# EAGLE design PedoBreakOutv1 (EAGLE 9.5.2)
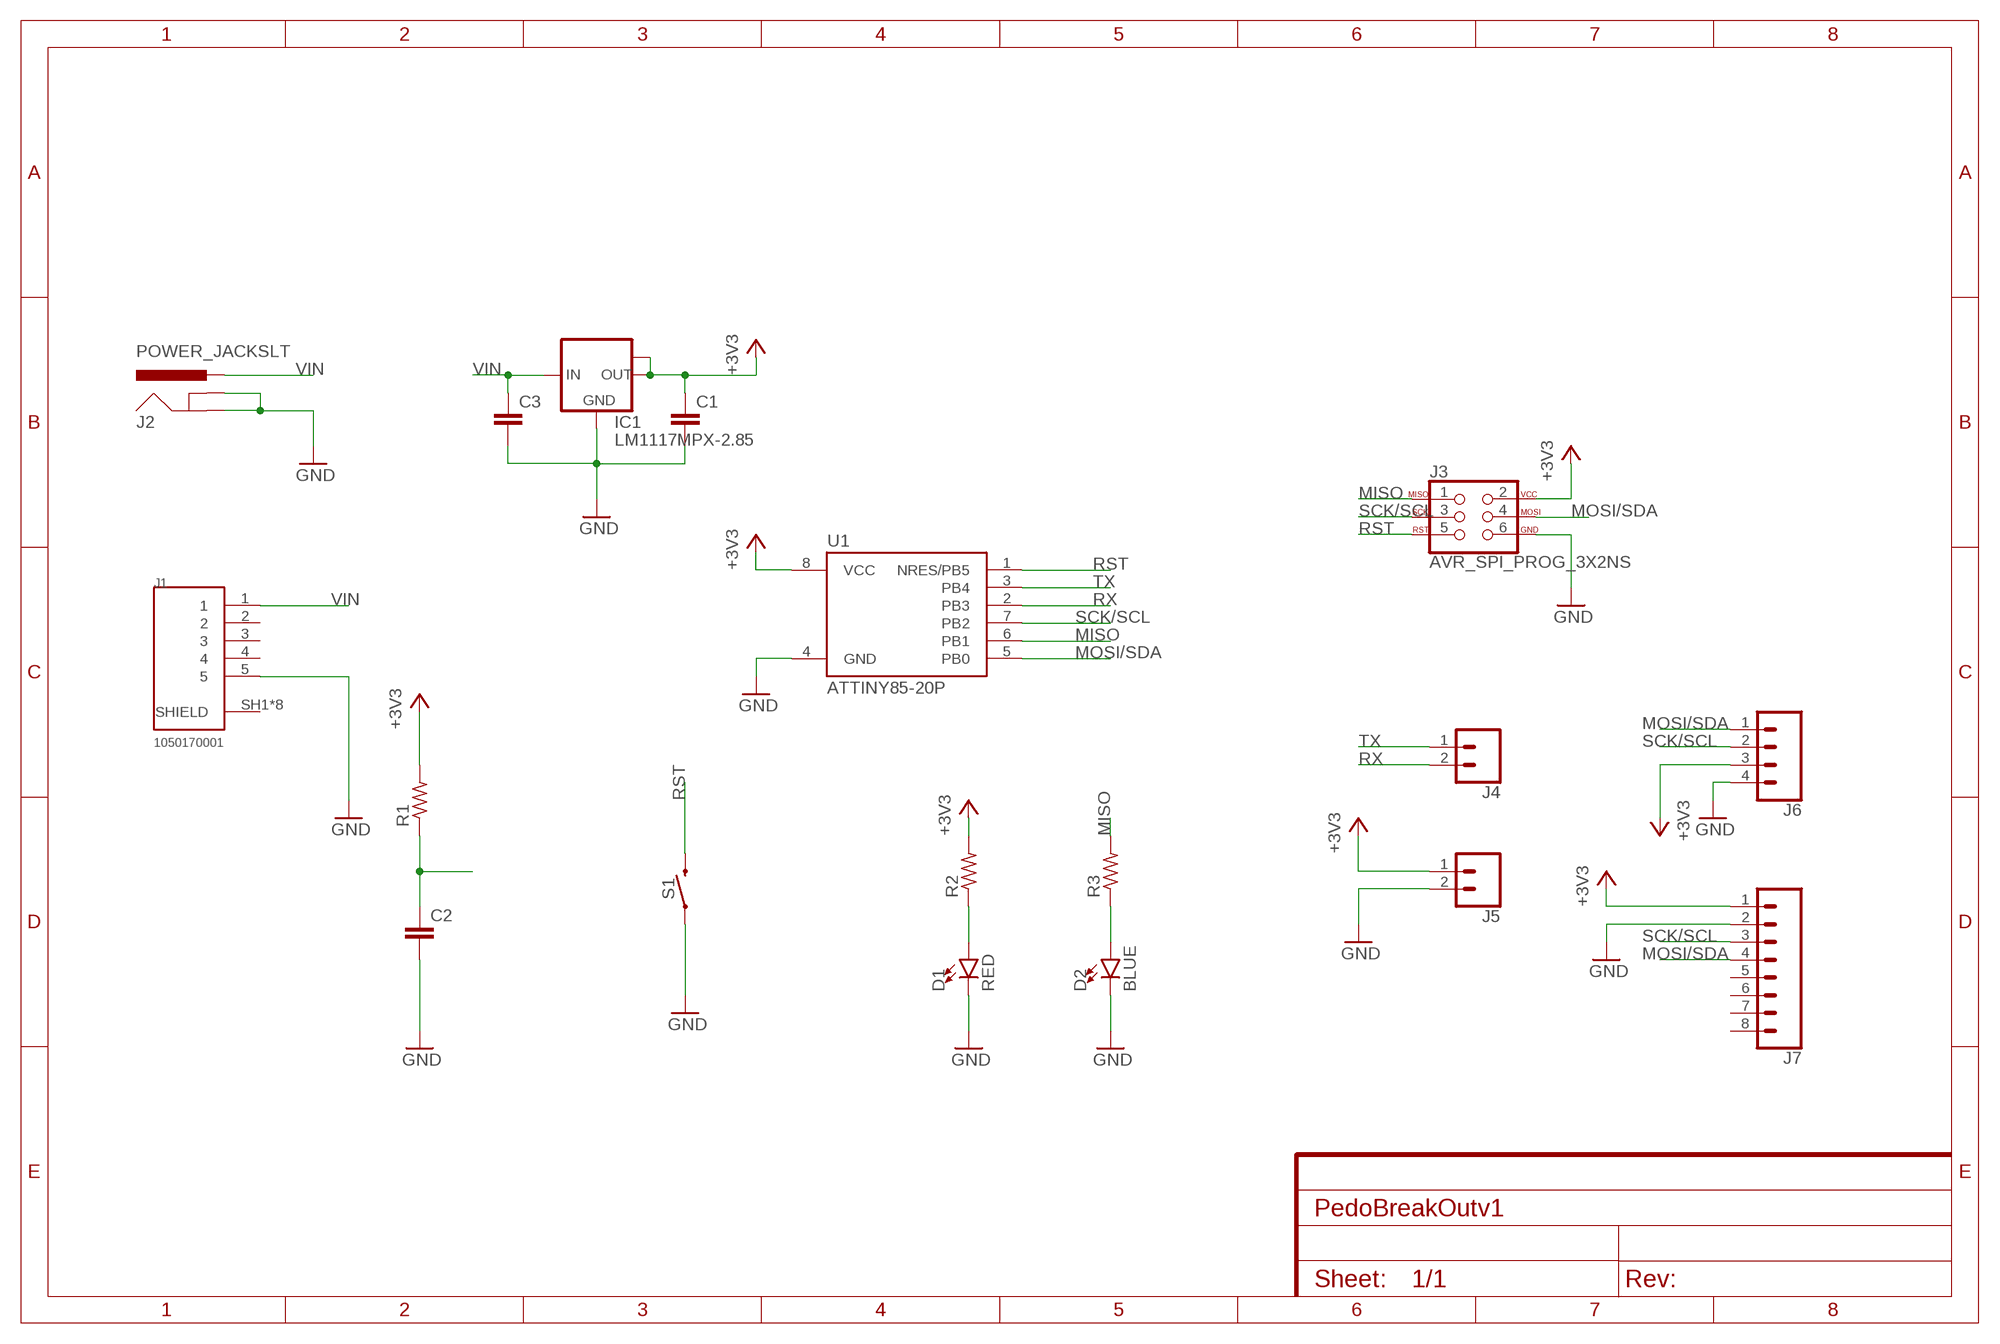
[diagram p0: schematic, sheet 1]

## Parts
C1  C-EUC0805  [C0805]
C2  C-EUC0805  [C0805]
C3  C-EUC0805  [C0805]
D1  RED  LED-RED0603  [LED-0603]
D2  BLUE  LED-BLUE0603  [LED-0603]
IC1  LM1117MPX-2.85  [SOT223]
J1  1050170001  [MOLEX_1050170001]
J2  POWER_JACKSLT  [POWER_JACK_SLOT]
J3  AVR_SPI_PROG_3X2NS  [2X3-NS]
J4  CONN_02  [1X02]
J5  CONN_02  [1X02]
J6  CONN_041X04_NO_SILK  [1X04_NO_SILK]
J7  CONN_08NO_SILK_FEMALE_PTH  [1X08_NO_SILK]
R1  R-US_M0805  [M0805]
R2  R-US_M0805  [M0805]
R3  R-US_M0805  [M0805]
S1  MOMENTARY-SWITCH-SPST-PTH-6.0MM  [TACTILE_SWITCH_PTH_6.0MM]
U1  ATTINY85-20P  [PDIP08_300MIL]

## Nets
+3V3: C1.1 IC1.2(OUT) IC1.TAB(OUT1) J3.2 J5.1 J6.3 J7.1 R1.2 R2.2 U1.8(VCC)
GND: C1.2 C2.2 C3.2 D1.C D2.C IC1.1(GND) J1.5 J2.GND@1(GNDBREAK) J2.GND@2(GND) J3.6 J5.2 J6.4 J7.2 S1.1 U1.4(GND)
MISO: J3.1 R3.2 U1.6(PB1)
MOSI/SDA: J3.4 J6.1 J7.4 U1.5(PB0)
N$1: D1.A R2.1
N$2: C2.1 R1.1
N$3: D2.A R3.1
RST: J3.5 S1.3 U1.1(NRES/PB5)
RX: J4.2 U1.2(PB3)
SCK/SCL: J3.3 J6.2 J7.3 U1.7(PB2)
TX: J4.1 U1.3(PB4)
VIN: C3.1 IC1.3(IN) J1.1 J2.PWR
Unconnected: J1.2 J1.3 J1.4 J1.SH1(SHIELD) J1.SH2(SHIELD) J1.SH3(SHIELD) J1.SH4(SHIELD) J1.SH5(SHIELD) J1.SH6(SHIELD) J1.SH7(SHIELD) J1.SH8(SHIELD) J7.5 J7.6 J7.7 J7.8

## Library data of the parts
C1-C3 = rcl:C-EU: CAPACITOR, European symbol; SPICEPREFIX: C
D1 = SparkFun-LED:LED-RED: Red SMD LED Used in manufacturing of most products at SparkFun Packages: 0603 - SMD 0603 package [Product Link] <http://docs.avagotech.com/docs/AV02-0551EN> 0603 SMART - SMD 0603 SMART package ( more efficient and expensive)[Product Link] <http://www.osram-os.com/Graphics/XPic2/00077099_0.pdf> 1206 - SMD1206 package [Product Link] <https://www.sparkfun.com/datasheets/DevTools/LilyPad/Q150OVS4.pdff> SparkFun Products: Pro Mini 328 -5V <https://www.sparkfun.com/products/821> RedBoard <https://www.sparkfun.com/products/12757> IOIO-OTG <https://www.sparkfun.com/products/13613>; PROD_ID: DIO-00819
D2 = SparkFun-LED:LED-BLUE: Blue SMD LED Used in manufacturing of various products at SparkFun Packages: 0603 - SMD 0603 package [Product Link] <http://www.digikey.com/product-detail/en/SMLE12BC7TT86/511-1589-2-ND/1641808> 1206 - SMD1206 package [Product Link] <http://www.digikey.com/product-detail/en/lite-on-inc/LTST-C150TBKT/160-1643-1-ND/573584> SparkFun Products: ESP8266 Thing-Dev Board <https://www.sparkfun.com/products/13711> RedBoard <https://www.sparkfun.com/products/12757>; PROD_ID: DIO-08575
IC1 = lm1117:LM1117MPX-*
J1 = 1050170001:1050170001: Conn.; Data; USB; Recept.; Micro; B Type; Bottom Mount, SMT, with Solder Tabs, Lead-Free; DESCRIPTION: USB - micro B USB 2.0 Receptacle Connector 5 Position Surface Mount, Right Angle; Through Hole; DIGI-KEY_PART_NUMBER: WM1399CT-ND; DIGI-KEY_PURCHASE_URL: https://www.digikey.in/product-detail/en/molex/1050170001/WM1399CT-ND/2350885?utm_source=snapeda&utm_medium=aggregator&utm_campaign=symbol; MF: Molex; MP: 1050170001; PACKAGE: None
J2 = SparkFun-Connectors:POWER_JACK: Power Jack Connector This is the standard 5.5mm barrel jack for power. The PTH is the most common, proven, reliable, footprint. The Slot footprint only works if the mill layer is transmitted to the PCB fab house so be warned. Here are the connectors we sell at SparkFun: DC Barrel Power Jack/Connector <https://www.sparkfun.com/products/119> (PRT-00119) DC Barrel Power Jack/Connector (SMD) <https://www.sparkfun.com/products/12748> (PRT-12748) DC Barrel Jack Adapter - Breadboard Compatible <https://www.sparkfun.com/products/10811> (PRT-10811) It is used on this SparkFun product (and many, many others): SparkFun RedBoard - Programmed with Arduino <https://www.sparkfun.com/products/12757> (DEV-12757) Also, if you need a mating power supply or connector, please check these out: Wall Adapter Power Supply - 9VDC 650mA <https://www.sparkfun.com/products/298> (TOL-00298) DC Barrel Jack Adapter - Male <https://www.sparkfun.com/products/10287> (PRT-10287); PROD_ID: PRT-00119
J3 = SparkFun-Connectors:AVR_SPI_PROG_3X2: AVR ISP 6 Pin This is the reduced ISP connector for AVR programming. Common on Arduino. This footprint will take up less PCB space and can be used with a 10-pin to 6-pin adapter such as SKU: BOB-08508 **Special note about "TEST_POINT" package. The stop mask is on the top side, so if you want your programming test points to be on the bottom of your board, make sure to place this package on the bottom side of the board. This also ensure that the orientation to program from the bottom side will be correct. SparkFun Products: SparkFun ISP Pogo Adapter <https://www.sparkfun.com/products/11591> - NS Tiny AVR Programmer <https://www.sparkfun.com/products/11801> -PTH
J4 J5 = SparkFun-Connectors:CONN_02: Multi connection point. Often used as Generic Header-pin footprint for 0.1 inch spaced/style header connections On any of the 0.1 inch spaced packages, you can populate with these: Break Away Headers - Straight <https://www.sparkfun.com/products/116> (PRT-00116) Break Away Male Headers - Right Angle <https://www.sparkfun.com/products/553> (PRT-00553) Female Headers <https://www.sparkfun.com/products/115> (PRT-00115) Break Away Headers - Machine Pin <https://www.sparkfun.com/products/117> (PRT-00117) Break Away Female Headers - Swiss Machine Pin <https://www.sparkfun.com/products/743> (PRT-00743) For SCREWTERMINALS and SPRING TERMINALS visit here: Screw Terimnals on SparkFun.com <https://www.sparkfun.com/search/results?term=Screw+Terminals> (5mm/3.5mm/2.54mm spacing) This device is also useful as a general connection point to wire up your design to another part of your project. Our various solder wires solder well into these plated through hole pads. Hook-Up Wire - Assortment (Stranded, 22 AWG) <https://www.sparkfun.com/products/11375> (PRT-11375) Hook-Up Wire - Assortment (Solid Core, 22 AWG) <https://www.sparkfun.com/products/11367> (PRT-11367) View the entire wire category on our website here <https://www.sparkfun.com/categories/141> Special notes: Molex polarized connector foot print use with: PRT-08233 with associated crimp pins and housings. 2.54_SCREWTERM for use with PRT-10571. 3.5mm Screw Terminal footprints for PRT-08084 5mm Screw Terminal footprints for use with PRT-08432
J6 = SparkFun-Connectors:CONN_04: Multi connection point. Often used as Generic Header-pin footprint for 0.1 inch spaced/style header connections On any of the 0.1 inch spaced packages, you can populate with these: Break Away Headers - Straight <https://www.sparkfun.com/products/116> (PRT-00116) Break Away Male Headers - Right Angle <https://www.sparkfun.com/products/553> (PRT-00553) Female Headers <https://www.sparkfun.com/products/115> (PRT-00115) Break Away Headers - Machine Pin <https://www.sparkfun.com/products/117> (PRT-00117) Break Away Female Headers - Swiss Machine Pin <https://www.sparkfun.com/products/743> (PRT-00743) For SCREWTERMINALS and SPRING TERMINALS visit here: Screw Terimnals on SparkFun.com <https://www.sparkfun.com/search/results?term=Screw+Terminals> (5mm/3.5mm/2.54mm spacing) This device is also useful as a general connection point to wire up your design to another part of your project. Our various solder wires solder well into these plated through hole pads. Hook-Up Wire - Assortment (Stranded, 22 AWG) <https://www.sparkfun.com/products/11375> (PRT-11375) Hook-Up Wire - Assortment (Solid Core, 22 AWG) <https://www.sparkfun.com/products/11367> (PRT-11367) View the entire wire category on our website here <https://www.sparkfun.com/categories/141> Special notes: Molex polarized connector foot print use with SKU : PRT-08231 with associated crimp pins and housings. 1MM SMD Version SKU: PRT-10208; PROD_ID: CONN-09696
J7 = SparkFun-Connectors:CONN_08: Multi connection point. Often used as Generic Header-pin footprint for 0.1 inch spaced/style header connections On any of the 0.1 inch spaced packages, you can populate with these: Break Away Headers - Straight <https://www.sparkfun.com/products/116> (PRT-00116) Break Away Male Headers - Right Angle <https://www.sparkfun.com/products/553> (PRT-00553) Female Headers <https://www.sparkfun.com/products/115> (PRT-00115) Break Away Headers - Machine Pin <https://www.sparkfun.com/products/117> (PRT-00117) Break Away Female Headers - Swiss Machine Pin <https://www.sparkfun.com/products/743> (PRT-00743) Arduino Stackable Header - 8 Pin <https://www.sparkfun.com/products/9279> (PRT-09279) For SCREWTERMINALS and SPRING TERMINALS visit here: Screw Terimnals on SparkFun.com <https://www.sparkfun.com/search/results?term=Screw+Terminals> (5mm/3.5mm/2.54mm spacing) This device is also useful as a general connection point to wire up your design to another part of your project. Our various solder wires solder well into these plated through hole pads. Hook-Up Wire - Assortment (Stranded, 22 AWG) <https://www.sparkfun.com/products/11375> (PRT-11375) Hook-Up Wire - Assortment (Solid Core, 22 AWG) <https://www.sparkfun.com/products/11367> (PRT-11367) View the entire wire category on our website here <https://www.sparkfun.com/categories/141> Special notes: Molex polarized connector foot print use with SKU : PRT-08231 with associated crimp pins and housings. 1MM SMD Version SKU: PRT-10208 NOTES ON THE VARIANTS LOCK and LOCK_LONGPADS... This footprint was designed to help hold the alignment of a through-hole component (i.e. 6-pin header) while soldering it into place. You may notice that each hole has been shifted either up or down by 0.005 of an inch from it's more standard position (which is a perfectly straight line). This slight alteration caused the pins (the squares in the middle) to touch the edges of the holes. Because they are alternating, it causes a "brace" to hold the component in place. 0.005 has proven to be the perfect amount of "off-center" position when using our standard breakaway headers. Although looks a little odd when you look at the bare footprint, once you have a header in there, the alteration is very hard to notice. Also,if you push a header all the way into place, it is covered up entirely on the bottom side.; PROD_ID: CONN-08438
R1-R3 = rcl:R-US_: RESISTOR, American symbol; SPICEPREFIX: R
S1 = SparkFun-Switches:MOMENTARY-SWITCH-SPST: Momentary Switch (Pushbutton) - SPST Normally-open (NO) SPST momentary switches (buttons, pushbuttons). Variants PTH-12MM - 12mm square, through-hole Momentary Pushbutton Switch - 12mm Square <https://www.sparkfun.com/products/9190> (COM-09190) PTH-6.0MM, PTH-6.0MM-KIT - 6.0mm square, through-hole Mini Pushbutton Switch <https://www.sparkfun.com/products/97> (COM-00097) KIT package intended for soldering kit's - only one side of pads' copper is exposed. PTH-RIGHT-ANGLE-KIT - Right-angle, through-hole Right Angle Tactile Button <https://www.sparkfun.com/products/10791> - Used on SparkFun BigTime Watch Kit <https://www.sparkfun.com/products/11734> SMD-12MM - 12mm square, surface-mount Tactile Button - SMD (12mm) <https://www.sparkfun.com/products/12993> (COM-12993) Used on SparkFun PicoBoard <https://www.sparkfun.com/products/11888> SMD-4.5MM - 4.5mm Square Trackball Switch Used on SparkFun Blackberry Trackballer Breakout <https://www.sparkfun.com/products/13169> SMD-4.6MMX2.8MM - 4.60mm x 2.80mm, surface mount Used on SparkFun SAMD21 Mini Breakout <https://www.sparkfun.com/products/13664> SMD-5.2MM, SMD-5.2-REDUNDANT - 5.2mm square, surface-mount Mini Pushbutton Switch - SMD <https://www.sparkfun.com/products/8720> (COM-08720) Used on Arduino Pro Mini <https://www.sparkfun.com/products/11114> REDUNDANT package connects both switch circuits together SMD-6.0X3.5MM - 6.0 x 3.5mm, surface mount Momentary Reset Switch SMD <https://www.sparkfun.com/products/8229> (COM-08229) SMD-6.2MM-TALL - 6.2mm square, surface mount Tactile Button - SMD (6mm) <https://www.sparkfun.com/products/12992> Used on SparkFun Digital Sandbox <https://www.sparkfun.com/products/12651> SMD-RIGHT-ANGLE - Right-angle, surface mount Used on SparkFun Block for Intel® Edison - Arduino <https://www.sparkfun.com/products/13036>; PROD_ID: SWCH-08441; SF_SKU: COM-00097
U1 = _hhn_attiny25_45_85:ATTINY85*: ATMEL ATtiny 85 Packages: P = PDIP 08 30mil S = SOIC 08 EIAJ 208mil Technologies Note: for complete ordering code (temp. range, finish, tape&reel etc.) see www.atmel.com • Supply Voltage: V = (1.8…5.5)V | [blank] = (2.7…5.5)V • Speed: 10 = 10 MHz | 20 = 20 MHz Author: Dipl.-Ing. FH Rainer Bayer HHN Hochschule Heilbronn (Heilbronn University), rainer.bayer@hs-heilbronn.de Ingenieurbüro ing-rb, mail@ing-rb.de

## Board
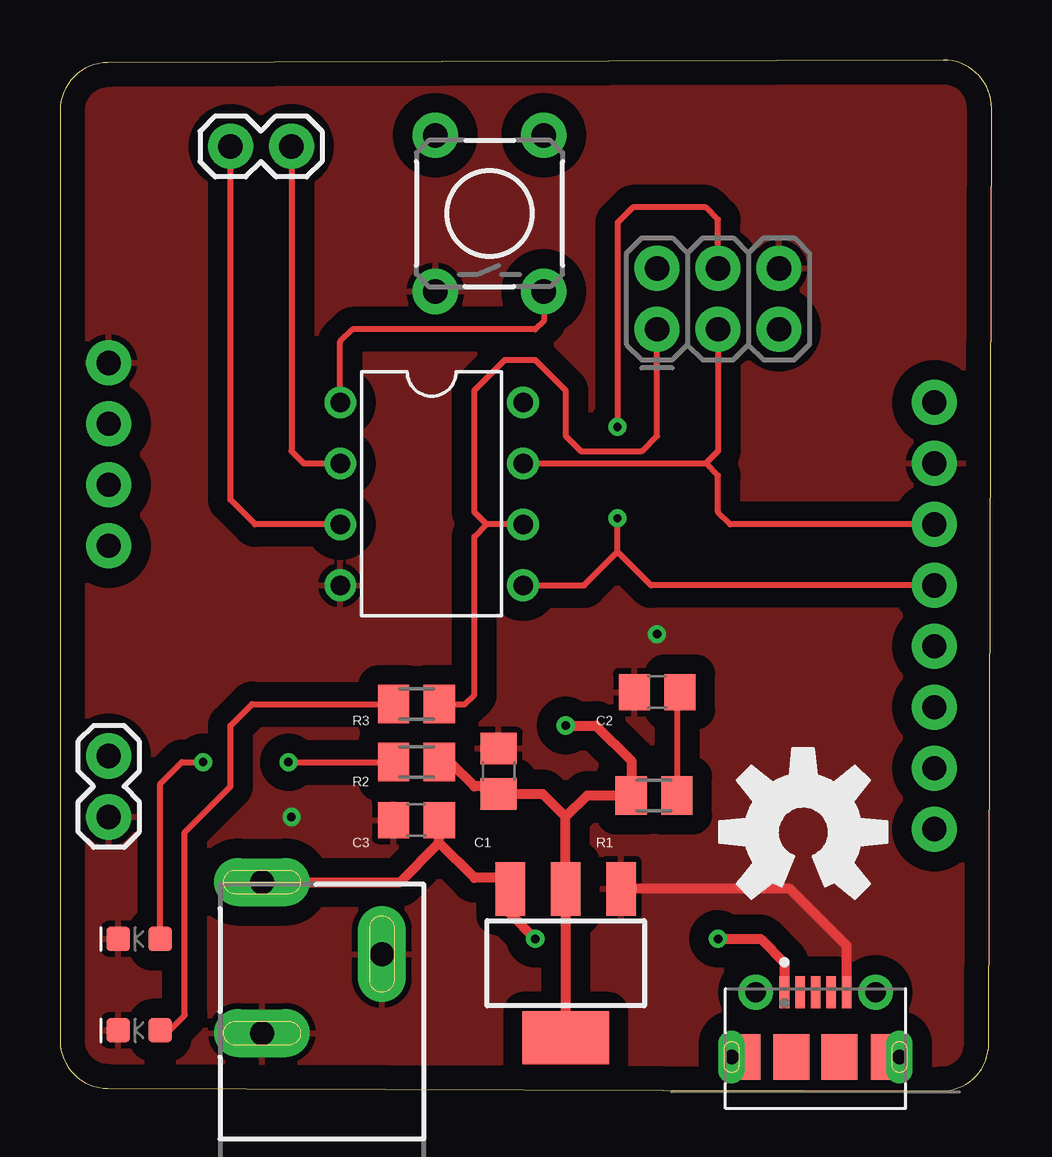
[diagram p1: board, top side]
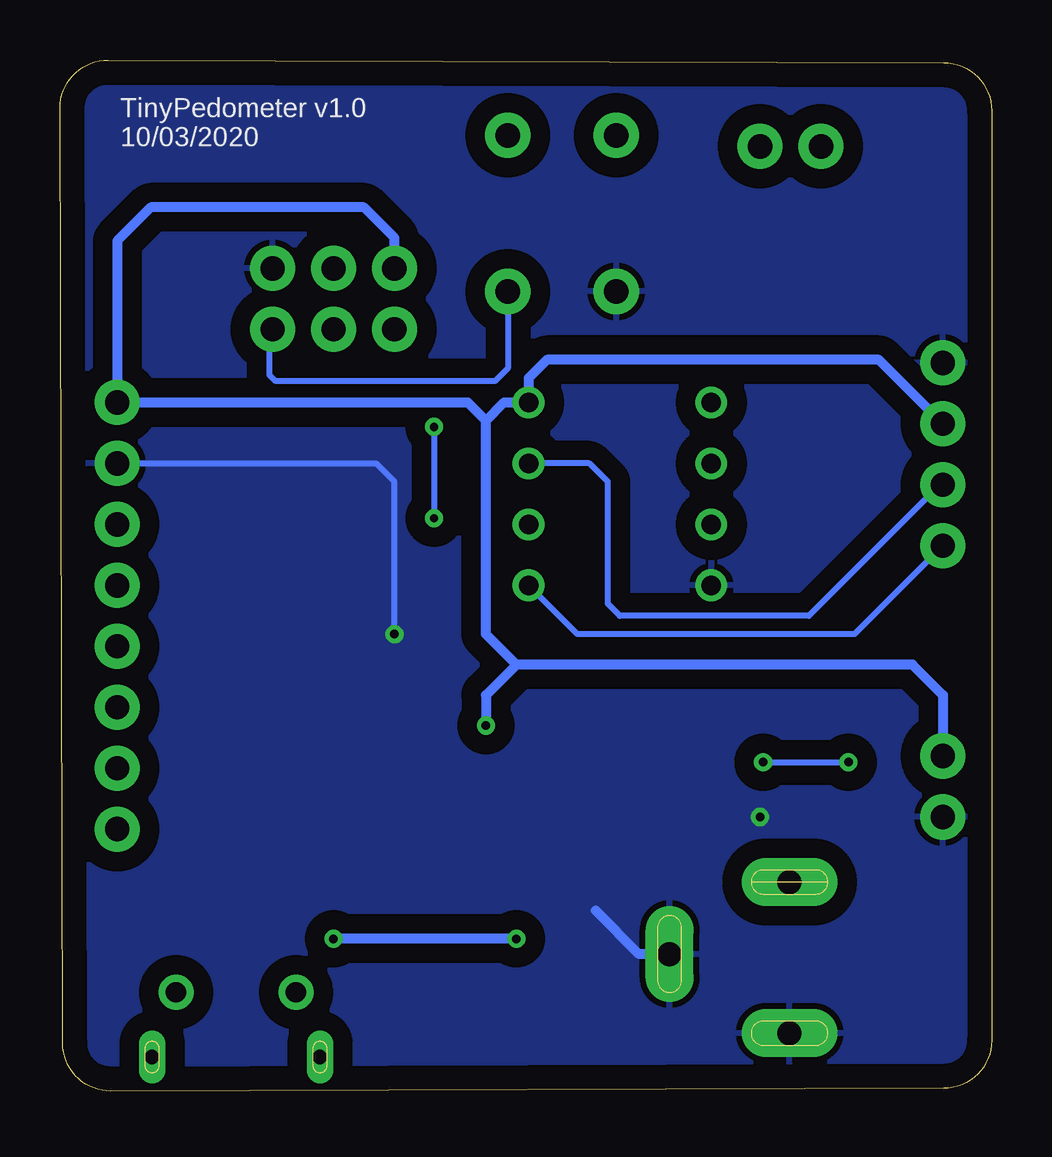
[diagram p2: board, bottom side, seen from below]

Size 38.84 x 42.96 mm. Coordinates in mm from the lower left corner, seen from the top.
Outline: 0,40.85 0,2.11 arc90 1.99,0.11 36.71,0 arc90 38.72,1.99 38.84,40.96 arc90 36.83,42.96 1.99,42.85 arc90 0,40.85
Copper layers (1*16): Top 0.035mm / dielectric 1.5mm / Bottom 0.035mm
Design rules "default": minimum track width 6mil, minimum drill 0.35mm, track to track 6mil, track to pad 6mil, pad to pad 6mil, via to via 6mil, smd to smd 6mil, copper to edge 40mil, drill to drill 6mil, minimum pad ring 10mil, minimum via ring 8mil, stop-mask expansion 4mil, vias tented up to drill 0mil, thermal gap 10mil

### Footprints (pad centres in the part's own frame; a part is rotated, then mirrored left to right if it is on the bottom)
C0805 = smd 1.3 x 1.5: 1 -0.95,0; 2 0.95,0
LED-0603 = smd 1 x 1: A -0.877,0; C 0.877,0
SOT223 = smd 1.219 x 2.235: 1 -2.311,-3.099; 2 0,-3.099; 3 2.311,-3.099 | smd 3.6 x 2.2: TAB 0,3.099
MOLEX_1050170001 = smd 0.4 x 1.35: 1 -1.3,2.35; 2 -0.65,2.35; 3 0,2.35; 4 0.65,2.35; 5 1.3,2.35 | drill 0.85 pad 1.45: SH1 -2.5,2.35; SH2 2.5,2.35 | drill 0.6 pad 0.95 long: SH3 -3.5,-0.35; SH8 3.5,-0.35 | smd 1.2 x 1.9: SH4 -2.9,-0.35; SH7 2.9,-0.35 | smd 1.5 x 1.9: SH5 -1,-0.35; SH6 1,-0.35
POWER_JACK_SLOT = drill 1 pad 2 long: GND@1 2.58,7.5; GND@2 7.58,10.8; PWR 2.58,13.8
2X3-NS = drill 1.016 pad 1.88: 1 -2.54,-1.27; 2 -2.54,1.27; 3 0,-1.27; 4 0,1.27; 5 2.54,-1.27; 6 2.54,1.27
1X02 = drill 1.016 pad 1.88: 1 0,0; 2 2.54,0
1X04_NO_SILK = drill 1.016 pad 1.88: 1 0,0; 2 2.54,0; 3 5.08,0; 4 7.62,0
1X08_NO_SILK = drill 1.016 pad 1.88: 1 0,0; 2 2.54,0; 3 5.08,0; 4 7.62,0; 5 10.16,0; 6 12.7,0; 7 15.24,0; 8 17.78,0
M0805 = smd 1.3 x 1.6: 1 -0.95,0; 2 0.95,0
TACTILE_SWITCH_PTH_6.0MM = drill 1.016 pad 1.88: 1 -3.251,2.261; 2 3.251,2.261; 3 -3.251,-2.261; 4 3.251,-2.261
PDIP08_300MIL = drill 0.813: 1 -3.81,-3.81; 2 -1.27,-3.81; 3 1.27,-3.81; 4 3.81,-3.81; 5 3.81,3.81; 6 1.27,3.81; 7 -1.27,3.81; 8 -3.81,3.81

### Placement (x,y rotation side)
C1  18.29,13.33 90 top
C2  24.89,16.63 180 top
C3  14.86,11.3 180 top
D1  3.3,6.34 180 top
D2  3.3,2.53 180 top
IC1  21.08,5.33 180 top
J1  31.5,1.77 0 top
J2  5.84,-5.09 0 top
J3  27.43,33.01 0 top
J4  7.11,39.36 0 top
J5  2.03,13.96 270 top
J6  2.03,22.73 90 top
J7  36.45,28.7 270 top
R1  24.77,12.31 180 top
R2  14.86,13.71 0 top
R3  14.86,16.12 0 top
S1  17.91,36.57 90 top
U1  15.49,24.89 270 top
U$1  [OSHW-LOGO-L]  30.99,10.79 0 top

### Tracks (layer width: path | path; a pad name or v marks a point on that pad's centre or on a via)
+3V3  (via drill 0.35)
  Top 0.406: 21.08,11.42 IC1.2 IC1.TAB | 21.08,11.42 21.97,12.31 R1.2 23.81,13.77 22.35,15.23 v21.08,15.23 | 21.08,11.42 20.13,12.38 C1.1 17.97,12.69 17.27,12.69 16.26,13.71 R2.2
  Bottom 0.406: 21.08,27.93 20.32,28.7 U1.8 19.3,29.71 18.54,30.47 4.7,30.47 J6.3 | 21.08,27.93 21.84,28.7 J7.1 36.45,35.43 35.05,36.82 26.16,36.82 24.89,35.55 J3.2 | J5.1 2.03,16.5 3.3,17.77 19.81,17.77 | 19.81,17.77 21.08,16.5 v21.08,15.23 | 19.81,17.77 21.08,19.04 21.08,27.93
GND  (via drill 0.35)
  Top 0.406: J1.5 32.8,6.06 30.43,8.43 IC1.1
  Bottom 0.254: J7.2 25.65,26.16 24.89,25.39 v24.89,19.04
  Bottom 0.406: J2.GND@2 14.69,5.71 16.51,7.53
  other vias: 9.65,11.42
  pour Top (isolate 0.813): 36.86,-0.01 1.95,-0.01 arc-90 -0.05,1.99 -0.05,40.67 arc-90 1.95,42.67 36.86,42.67 arc-90 38.86,40.67 38.86,1.99 arc-90
  pour Bottom (isolate 0.813): 38.86,40.71 38.86,1.99 arc-90 36.86,-0.01 1.95,-0.01 arc-90 -0.05,1.99 -0.05,40.71 arc-90 1.95,42.71 36.86,42.71 arc-90
MISO
  Top 0.254: U1.6 17.78,23.62 | 17.78,23.62 17.27,24.12 17.27,29.2 18.54,30.47 19.81,30.47 21.08,29.2 21.08,27.3 21.72,26.66 24.26,26.66 24.89,27.3 J3.1 | 17.78,23.62 17.27,23.11 17.27,16.5 16.89,16.12 R3.2
MOSI/SDA  (via drill 0.35)
  Top 0.254: J3.4 27.43,36.32 26.92,36.82 23.88,36.82 23.24,36.19 v23.24,27.68 | U1.5 21.84,21.08 23.24,22.47 | 23.24,22.47 v23.24,23.87 | J7.4 24.64,21.08 23.24,22.47
  Bottom 0.254: J6.1 5.71,19.04 17.27,19.04 U1.5 | v23.24,27.68 v23.24,23.87
N$1  (via drill 0.35)
  Top 0.254: D1.A 4.18,12.81 5.08,13.71 v5.97,13.71 | v9.53,13.71 R2.1
  Bottom 0.254: v9.53,13.71 v5.97,13.71
N$2
  Top 0.254: C2.1 25.72,16.5 R1.1
N$3
  Top 0.254: D2.A 4.57,2.53 5.21,3.17 5.21,10.79 7.11,12.69 7.11,15.23 8,16.12 R3.1
RST
  Top 0.254: U1.1 11.68,31.24 12.19,31.74 19.81,31.74 20.17,32.1 S1.3
  Bottom 0.254: S1.3 20.17,30.12 20.7,29.58 29.84,29.58 30.1,29.84 30.1,31.62 J3.5
RX
  Top 0.254: J4.2 9.65,26.66 10.16,26.16 U1.2
SCK/SCL
  Top 0.254: U1.7 26.92,26.16 | J3.3 27.43,26.66 26.92,26.16 | J7.3 27.94,23.62 27.43,24.12 27.43,25.65 26.92,26.16
  Bottom 0.254: J6.2 2.16,25.27 7.62,19.81 15.49,19.81 16,20.31 16,25.39 16.76,26.16 U1.7
TX
  Top 0.254: U1.3 8.13,23.62 7.11,24.63 J4.1
VIN  (via drill 0.35)
  Top 0.406: v27.43,6.34 29.21,6.34 30.2,5.36 J1.1 | v19.81,6.34 18.77,7.38 IC1.3 18.43,8.77 18.43,9 18.31,8.88 17.27,8.88 15.81,10.35 | 15.81,10.35 C3.1 | J2.PWR 14.18,8.71 15.81,10.35
  Bottom 0.406: v19.81,6.34 v27.43,6.34

### Text on the board
tNames: R3 | C2 | R2 | C3 | C1 | R1
bNames: TinyPedometer v1.0 / 10/03/2020